# Altium schematic sheet 74VHCT14AM1.SchDoc
size A4; SheetNumber: 4; SheetTotal: 10
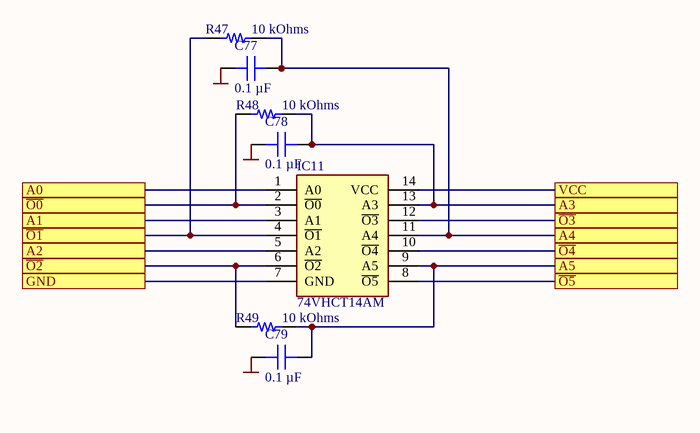
[diagram p0: 74VHCT14AM1.SchDoc]

## Parts
C77  0.1 µF  [CAP 0603_1608]
C78  0.1 µF  [CAP 0603_1608]
C79  0.1 µF  [CAP 0603_1608]
IC11  74VHCT14AM  [SOIC127P600X175-14N]
R47  10 kOhms  [RES 0603_1608]
R48  10 kOhms  [RES 0603_1608]
R49  10 kOhms  [RES 0603_1608]

## Ports
A0, A1, A2, A3, A4, A5, GND, VCC, ~{O0}, ~{O1}, ~{O2}, ~{O3}, ~{O4}, ~{O5}

## Nets
GND: C77.2 C78.2 C79.2
A0: IC11.1(A0) ; port A0
A1: IC11.3(A1) ; port A1
A2: IC11.5(A2) ; port A2
A3: C78.1 IC11.13(A3) R48.2 ; port A3
A4: C77.1 IC11.11(A4) R47.2 ; port A4
A5: C79.1 IC11.9(A5) R49.2 ; port A5
GND: IC11.7(GND) ; port GND  [a separate net that carries the same name]
~{O0}: IC11.2(~{O0}) R48.1 ; port ~{O0}
~{O1}: IC11.4(~{O1}) R47.1 ; port ~{O1}
~{O2}: IC11.6(~{O2}) R49.1 ; port ~{O2}
~{O3}: IC11.12(~{O3}) ; port ~{O3}
~{O4}: IC11.10(~{O4}) ; port ~{O4}
~{O5}: IC11.8(~{O5}) ; port ~{O5}
VCC: IC11.14(VCC) ; port VCC

## Library data of the parts
C77-C79 = C0603C104K5RAC7411: CAP CER 0.1UF 50V X7R 0603; manufacturer: KEMET; Tolerance: ±10%; Part Number: C0603C104K5RAC7411; Value: 0.1 µF; Applications: Bypass, Decoupling; Capacitance: 0.1 µF; componentlink1description: Datasheet; componentlink1url: https://api.kemet.com/component-edge/download/datasheet/C0603C104K5RAC7411.pdf; componentlink2description: DigiKey Link; componentlink2url: https://www.digikey.com/en/products/detail/kemet/C0603C104K5RAC7411/3317013; Device Package: 0603 (1608 Metric); lastupdated: 2/9/2024 8:10:30 PM; Lifecycle Status: Active; Minimum Order: 1; Mounting Type: Surface Mount, MLCC; Operating Temperature: -55°C ~ 125°C; Package / Case: 0603 (1608 Metric); packaging: TapeAndReel; partid: 2233; Part Status: Active; price: 0.01; series: SMD Comm X7R; Size / Dimension: 0.063" L x 0.031" W (1.60mm x 0.80mm); Supplier 1: DigiKey; Supplier Part Number 1: 399-C0603C104K5RAC7411CT-ND; Temperature Coefficient: X7R; Thickness (Max): 0.035" (0.90mm); Voltage - Rated: 50V
IC11 = 74VHCT14AM: Integrated Circuit; Manufacturer_Name: onsemi; Datasheet Link: https://docs.rs-online.com/5e2e/0900766b812cf5b5.pdf; Height: 1.75mm; Manufacturer_Part_Number: 74VHCT14AM; Mouser Part Number: 512-74VHCT14AM; Mouser Price/Stock: https://www.mouser.com/Search/Refine.aspx?Keyword=512-74VHCT14AM; Arrow Part Number: 74VHCT14AM; Arrow Price/Stock: https://www.arrow.com/en/products/74vhct14am/on-semiconductor
R47-R49 = ERJ-3EKF1002V: RES SMD 10K OHM 1% 1/10W 0603; Manufacturer: Panasonic Electronic Components; Power (Watts): 0.1W, 1/10W; Temperature Coefficient: ±100ppm/°C; Part Number: ERJ-3EKF1002V; Value: 10 kOhms; ComponentLink1Description: Datasheet; ComponentLink1URL: https://industrial.panasonic.com/cdbs/www-data/pdf/RDA0000/AOA0000C304.pdf; ComponentLink2Description: DigiKey Link; ComponentLink2URL: https://www.digikey.com/en/products/detail/panasonic-electronic-components/ERJ-3EKF1002V/196066; Composition: Thick Film; Device Package: 0603 (1608 Metric); Height - Seated (Max): 0.022" (0.55mm); LastUpdated: 2/9/2024 8:41:59 PM; Lifecycle Status: Active; Minimum Order: 1; Number of Terminations: 2; Operating Temperature: -55°C ~ 155°C; Package / Case: 0603 (1608 Metric); Packaging: TapeAndReel; PartId: 25695; Part Status: Active; Price: 0.01; Resistance: 10 kOhms; Series: ERJ-3EK; Size / Dimension: 0.063" L x 0.031" W (1.60mm x 0.80mm); Supplier 1: DigiKey; Supplier Part Number 1: P10.0KHCT-ND; Supplier Device Package: 0603; Tolerance: ±1%; Features: Automotive AEC-Q200; Ratings: AEC-Q200